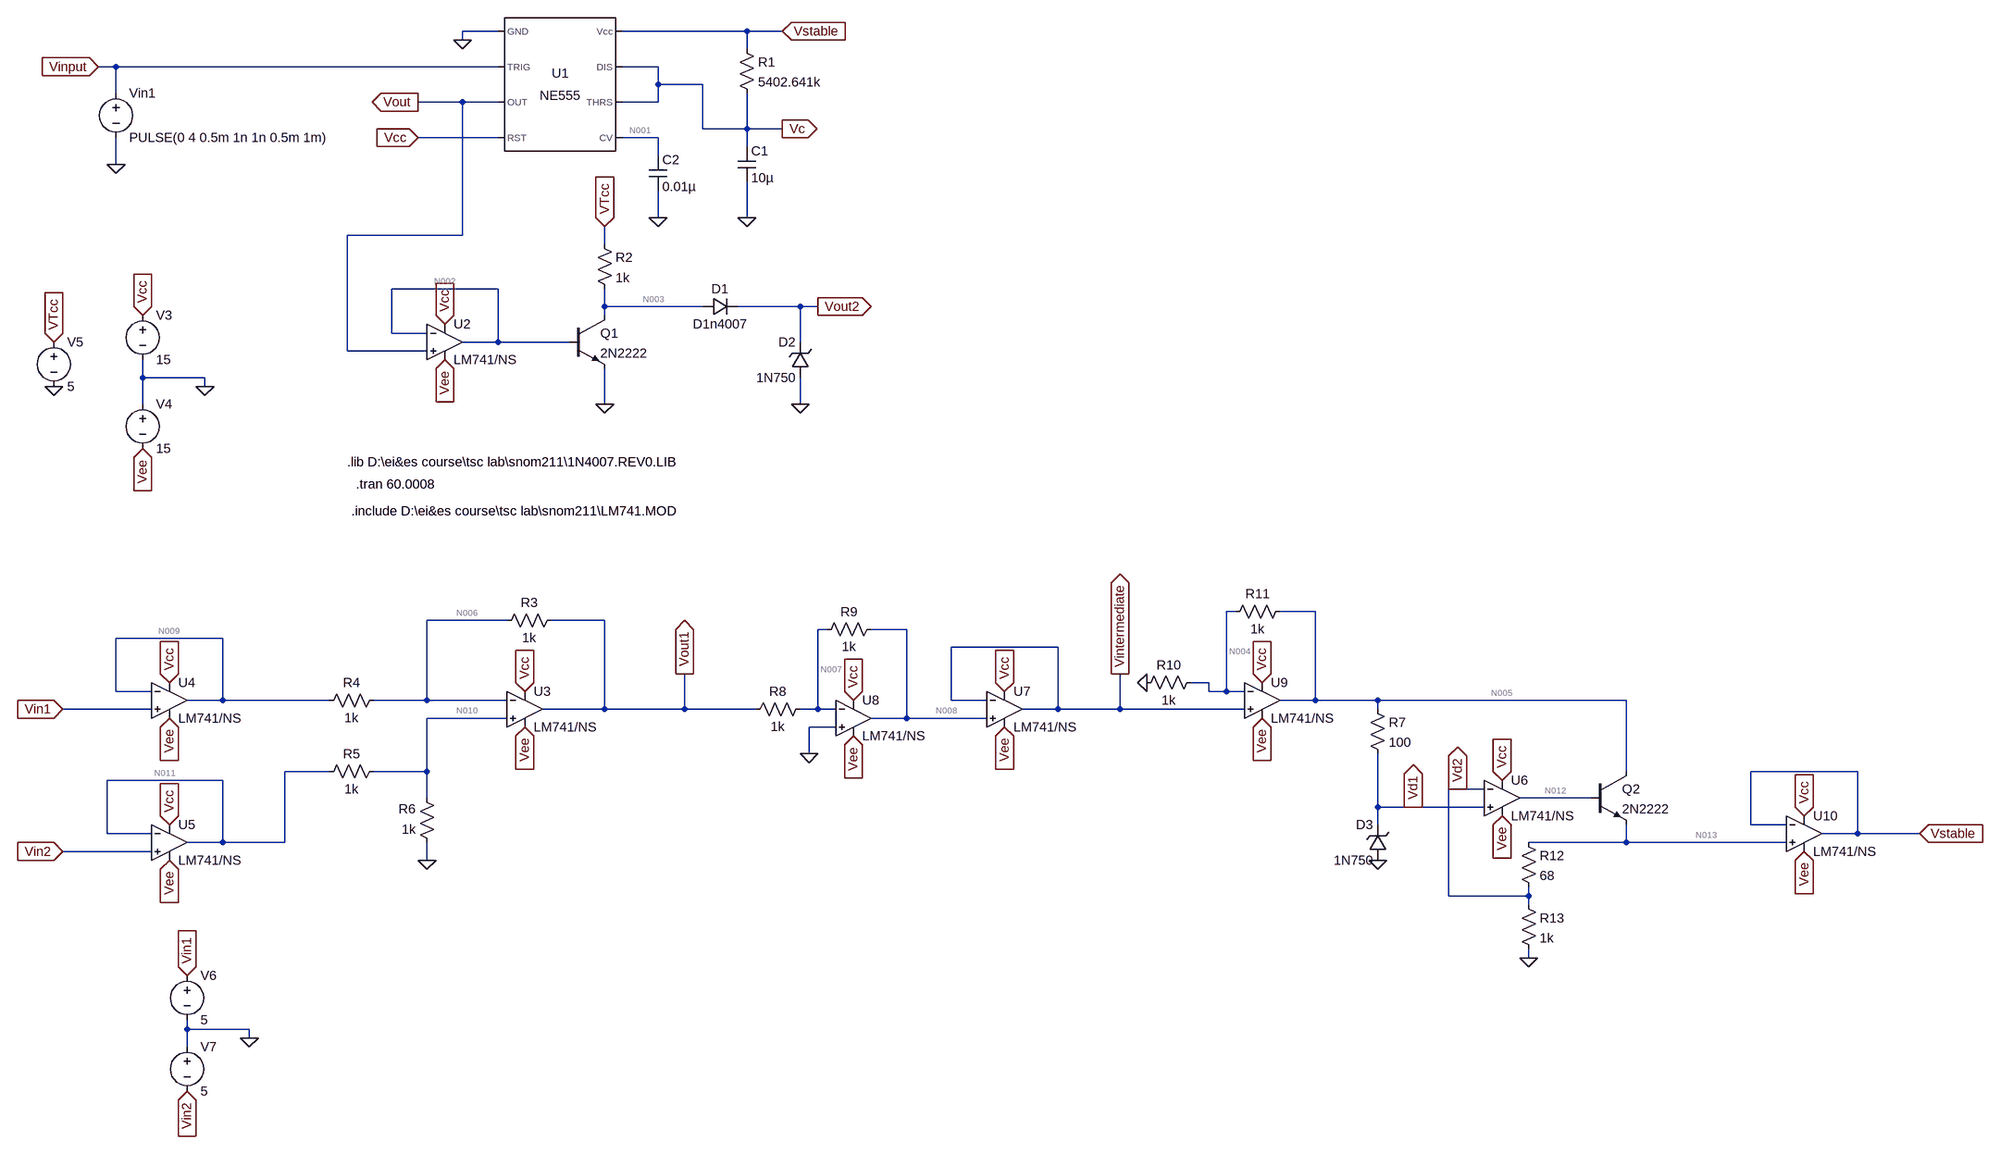
[diagram p0: schematic Project.asc]
Project.asc, the LTspice schematic file:
Version 4
SHEET 1 2816 2112
WIRE 112 64 48 64
WIRE 560 64 336 64
WIRE 624 64 560 64
WIRE 48 80 48 64
WIRE 560 96 560 64
WIRE -576 128 -608 128
WIRE 112 128 -576 128
WIRE 400 128 336 128
WIRE 400 160 400 128
WIRE 480 160 400 160
WIRE -576 176 -576 128
WIRE 48 192 -32 192
WIRE 112 192 48 192
WIRE 400 192 400 160
WIRE 400 192 336 192
WIRE 480 240 480 160
WIRE 560 240 560 176
WIRE 560 240 480 240
WIRE 624 240 560 240
WIRE 112 256 -32 256
WIRE 400 256 336 256
WIRE 560 272 560 240
WIRE 400 288 400 256
WIRE -576 304 -576 256
WIRE 400 400 400 352
WIRE 560 400 560 336
WIRE 48 432 48 192
WIRE 48 432 -160 432
WIRE 304 448 304 416
WIRE 112 528 -80 528
WIRE 304 560 304 528
WIRE 480 560 304 560
WIRE 656 560 544 560
WIRE 688 560 656 560
WIRE 304 576 304 560
WIRE -80 608 -80 528
WIRE -16 608 -80 608
WIRE 112 624 112 528
WIRE 112 624 48 624
WIRE 240 624 112 624
WIRE 656 624 656 560
WIRE -160 640 -160 432
WIRE -16 640 -160 640
WIRE -528 688 -528 656
WIRE -416 688 -528 688
WIRE -416 704 -416 688
WIRE -528 736 -528 688
WIRE 304 736 304 672
WIRE 656 736 656 688
WIRE 1440 1136 1424 1136
WIRE 1584 1136 1520 1136
WIRE 128 1152 -16 1152
WIRE 304 1152 208 1152
WIRE 704 1168 688 1168
WIRE 848 1168 784 1168
WIRE -384 1184 -576 1184
WIRE 1120 1200 928 1200
WIRE 1392 1264 1360 1264
WIRE -576 1280 -576 1184
WIRE -512 1280 -576 1280
WIRE 1392 1280 1392 1264
WIRE 1424 1280 1424 1136
WIRE 1424 1280 1392 1280
WIRE 1456 1280 1424 1280
WIRE -384 1296 -384 1184
WIRE -384 1296 -448 1296
WIRE -192 1296 -384 1296
WIRE -16 1296 -16 1152
WIRE -16 1296 -112 1296
WIRE 128 1296 -16 1296
WIRE 928 1296 928 1200
WIRE 992 1296 928 1296
WIRE 1584 1296 1584 1136
WIRE 1584 1296 1520 1296
WIRE 1696 1296 1584 1296
WIRE 2144 1296 1696 1296
WIRE -512 1312 -672 1312
WIRE 304 1312 304 1152
WIRE 304 1312 192 1312
WIRE 448 1312 448 1248
WIRE 448 1312 304 1312
WIRE 576 1312 448 1312
WIRE 688 1312 688 1168
WIRE 688 1312 656 1312
WIRE 720 1312 688 1312
WIRE 1120 1312 1120 1200
WIRE 1120 1312 1056 1312
WIRE 1232 1312 1232 1248
WIRE 1232 1312 1120 1312
WIRE 1456 1312 1232 1312
WIRE 1696 1312 1696 1296
WIRE 128 1328 -16 1328
WIRE 848 1328 848 1168
WIRE 848 1328 784 1328
WIRE 992 1328 848 1328
WIRE 720 1344 672 1344
WIRE 672 1392 672 1344
WIRE -192 1424 -272 1424
WIRE -16 1424 -16 1328
WIRE -16 1424 -112 1424
WIRE 2144 1424 2144 1296
WIRE 2560 1424 2368 1424
WIRE -384 1440 -592 1440
WIRE 1840 1456 1824 1456
WIRE 1888 1456 1840 1456
WIRE -16 1472 -16 1424
WIRE 2080 1472 1952 1472
WIRE 1696 1488 1696 1392
WIRE 1760 1488 1696 1488
WIRE 1888 1488 1760 1488
WIRE 1696 1520 1696 1488
WIRE 2368 1520 2368 1424
WIRE 2432 1520 2368 1520
WIRE -592 1536 -592 1440
WIRE -512 1536 -592 1536
WIRE 2560 1536 2560 1424
WIRE 2560 1536 2496 1536
WIRE 2672 1536 2560 1536
WIRE -384 1552 -384 1440
WIRE -384 1552 -448 1552
WIRE -272 1552 -272 1424
WIRE -272 1552 -384 1552
WIRE 2144 1552 2144 1520
WIRE 2144 1552 1968 1552
WIRE 2432 1552 2144 1552
WIRE -512 1568 -672 1568
WIRE -16 1584 -16 1552
WIRE 1824 1648 1824 1456
WIRE 1968 1648 1968 1632
WIRE 1968 1648 1824 1648
WIRE 1968 1664 1968 1648
WIRE 1968 1760 1968 1744
WIRE -448 1888 -448 1872
WIRE -336 1888 -448 1888
WIRE -336 1904 -336 1888
WIRE -448 1920 -448 1888
FLAG 560 400 0
FLAG 304 736 0
FLAG 656 736 0
FLAG 16 592 Vcc
IOPIN 16 592 In
FLAG 16 656 Vee
IOPIN 16 656 In
FLAG -416 704 0
FLAG -528 576 Vcc
IOPIN -528 576 In
FLAG -528 816 Vee
IOPIN -528 816 In
FLAG 688 560 Vout2
IOPIN 688 560 Out
FLAG -688 704 0
FLAG -688 624 VTcc
IOPIN -688 624 In
FLAG 624 64 Vstable
IOPIN 624 64 In
FLAG -32 256 Vcc
IOPIN -32 256 In
FLAG 624 240 Vc
IOPIN 624 240 Out
FLAG 400 400 0
FLAG 48 80 0
FLAG -576 304 0
FLAG -608 128 Vinput
IOPIN -608 128 In
FLAG -32 192 Vout
IOPIN -32 192 Out
FLAG 304 416 VTcc
IOPIN 304 416 In
FLAG 160 1280 Vcc
IOPIN 160 1280 In
FLAG 160 1344 Vee
IOPIN 160 1344 In
FLAG -16 1584 0
FLAG -480 1264 Vcc
IOPIN -480 1264 In
FLAG -480 1328 Vee
IOPIN -480 1328 In
FLAG -480 1520 Vcc
IOPIN -480 1520 In
FLAG -480 1584 Vee
IOPIN -480 1584 In
FLAG -672 1312 Vin1
IOPIN -672 1312 In
FLAG -672 1568 Vin2
IOPIN -672 1568 In
FLAG -336 1904 0
FLAG -448 1792 Vin1
IOPIN -448 1792 In
FLAG -448 2000 Vin2
IOPIN -448 2000 In
FLAG 1920 1440 Vcc
IOPIN 1920 1440 In
FLAG 1920 1504 Vee
IOPIN 1920 1504 In
FLAG 1696 1584 0
FLAG 1024 1280 Vcc
IOPIN 1024 1280 In
FLAG 1024 1344 Vee
IOPIN 1024 1344 In
FLAG 448 1248 Vout1
IOPIN 448 1248 Out
FLAG 1232 1248 Vintermediate
IOPIN 1232 1248 Out
FLAG 752 1296 Vcc
IOPIN 752 1296 In
FLAG 752 1360 Vee
IOPIN 752 1360 In
FLAG 672 1392 0
FLAG 1760 1488 Vd1
IOPIN 1760 1488 Out
FLAG 1840 1456 Vd2
IOPIN 1840 1456 Out
FLAG 1488 1264 Vcc
IOPIN 1488 1264 In
FLAG 1488 1328 Vee
IOPIN 1488 1328 In
FLAG 1280 1264 0
FLAG 1968 1760 0
FLAG 2464 1504 Vcc
IOPIN 2464 1504 In
FLAG 2464 1568 Vee
IOPIN 2464 1568 In
FLAG 2672 1536 Vstable
IOPIN 2672 1536 In
SYMBOL Misc\\NE555 224 160 R0
SYMATTR InstName U1
SYMBOL voltage -576 160 R0
WINDOW 123 0 0 Left 0
WINDOW 39 0 0 Left 0
SYMATTR InstName Vin1
SYMATTR Value PULSE(0 4 0.5m 1n 1n 0.5m 1m)
SYMBOL res 544 80 R0
SYMATTR InstName R1
SYMATTR Value 5402.641k
SYMBOL cap 384 288 R0
SYMATTR InstName C2
SYMATTR Value 0.01µ
SYMBOL cap 544 272 R0
SYMATTR InstName C1
SYMATTR Value 10µ
SYMBOL npn 240 576 R0
SYMATTR InstName Q1
SYMATTR Value 2N2222
SYMBOL diode 480 576 R270
WINDOW 0 32 32 VTop 2
WINDOW 3 0 32 VBottom 2
SYMATTR InstName D1
SYMATTR Value D1n4007
SYMBOL zener 672 688 R180
WINDOW 0 24 64 Left 2
WINDOW 3 24 0 Left 2
SYMATTR InstName D2
SYMATTR Value 1N750
SYMBOL OpAmps\\opamp2 16 560 R0
SYMATTR InstName U2
SYMATTR Value LM741/NS
SYMBOL voltage -528 560 R0
WINDOW 123 0 0 Left 0
WINDOW 39 0 0 Left 0
SYMATTR InstName V3
SYMATTR Value 15
SYMBOL voltage -528 720 R0
WINDOW 123 0 0 Left 0
WINDOW 39 0 0 Left 0
SYMATTR InstName V4
SYMATTR Value 15
SYMBOL voltage -688 608 R0
WINDOW 123 0 0 Left 0
WINDOW 39 0 0 Left 0
SYMATTR InstName V5
SYMATTR Value 5
SYMBOL res 288 432 R0
SYMATTR InstName R2
SYMATTR Value 1k
SYMBOL OpAmps\\opamp2 160 1248 R0
SYMATTR InstName U3
SYMATTR Value LM741/NS
SYMBOL res 224 1136 R90
WINDOW 0 0 56 VBottom 2
WINDOW 3 32 56 VTop 2
SYMATTR InstName R3
SYMATTR Value 1k
SYMBOL res -96 1280 R90
WINDOW 0 0 56 VBottom 2
WINDOW 3 32 56 VTop 2
SYMATTR InstName R4
SYMATTR Value 1k
SYMBOL res -96 1408 R90
WINDOW 0 0 56 VBottom 2
WINDOW 3 32 56 VTop 2
SYMATTR InstName R5
SYMATTR Value 1k
SYMBOL res 0 1568 R180
WINDOW 0 36 76 Left 2
WINDOW 3 36 40 Left 2
SYMATTR InstName R6
SYMATTR Value 1k
SYMBOL OpAmps\\opamp2 -480 1232 R0
SYMATTR InstName U4
SYMATTR Value LM741/NS
SYMBOL OpAmps\\opamp2 -480 1488 R0
SYMATTR InstName U5
SYMATTR Value LM741/NS
SYMBOL voltage -448 1776 R0
WINDOW 123 0 0 Left 0
WINDOW 39 0 0 Left 0
SYMATTR InstName V6
SYMATTR Value 5
SYMBOL voltage -448 1904 R0
WINDOW 123 0 0 Left 0
WINDOW 39 0 0 Left 0
SYMATTR InstName V7
SYMATTR Value 5
SYMBOL npn 2080 1424 R0
SYMATTR InstName Q2
SYMATTR Value 2N2222
SYMBOL OpAmps\\opamp2 1920 1408 R0
SYMATTR InstName U6
SYMATTR Value LM741/NS
SYMBOL res 1680 1296 R0
SYMATTR InstName R7
SYMATTR Value 100
SYMATTR SpiceLine pwr=0.25
SYMBOL zener 1712 1584 R180
WINDOW 0 24 64 Left 2
WINDOW 3 24 0 Left 2
SYMATTR InstName D3
SYMATTR Value 1N750
SYMBOL OpAmps\\opamp2 1024 1248 R0
SYMATTR InstName U7
SYMATTR Value LM741/NS
SYMBOL OpAmps\\opamp2 752 1264 R0
SYMATTR InstName U8
SYMATTR Value LM741/NS
SYMBOL res 672 1296 R90
WINDOW 0 0 56 VBottom 2
WINDOW 3 32 56 VTop 2
SYMATTR InstName R8
SYMATTR Value 1k
SYMBOL res 800 1152 R90
WINDOW 0 0 56 VBottom 2
WINDOW 3 32 56 VTop 2
SYMATTR InstName R9
SYMATTR Value 1k
SYMBOL OpAmps\\opamp2 1488 1232 R0
SYMATTR InstName U9
SYMATTR Value LM741/NS
SYMBOL res 1376 1248 R90
WINDOW 0 0 56 VBottom 2
WINDOW 3 32 56 VTop 2
SYMATTR InstName R10
SYMATTR Value 1k
SYMBOL res 1536 1120 R90
WINDOW 0 0 56 VBottom 2
WINDOW 3 32 56 VTop 2
SYMATTR InstName R11
SYMATTR Value 1k
SYMBOL res 1952 1536 R0
SYMATTR InstName R12
SYMATTR Value 68
SYMBOL res 1952 1648 R0
SYMATTR InstName R13
SYMATTR Value 1k
SYMBOL OpAmps\\opamp2 2464 1472 R0
SYMATTR InstName U10
SYMATTR Value LM741/NS
TEXT -144 880 Left 2 !.tran 60.0008
TEXT -160 840 Left 2 !.lib D:\\ei&es course\\tsc lab\\snom211\\1N4007.REV0.LIB
TEXT -152 928 Left 2 !.include D:\\ei&es course\\tsc lab\\snom211\\LM741.MOD

The netlist it stands for:
* Project.asc
XU1 0 Vinput Vout Vcc N001 Vc Vc Vstable NE555  ; pins GND TRIG OUT RST CV THRS DIS Vcc
Vin1 Vinput 0 PULSE(0 4 0.5m 1n 1n 0.5m 1m)
R1 Vstable Vc 5402.641k
C2 N001 0 0.01µ
C1 Vc 0 10µ
Q1 N003 N002 0 0 2N2222
D1 N003 Vout2 D1n4007
D2 0 Vout2 1N750
XU2 Vout N002 Vcc Vee N002 LM741/NS  ; pins In+ In- V+ V- OUT
V3 Vcc 0 15
V4 0 Vee 15
V5 VTcc 0 5
R2 VTcc N003 1k
XU3 N010 N006 Vcc Vee Vout1 LM741/NS  ; pins In+ In- V+ V- OUT
R3 Vout1 N006 1k
R4 N006 N009 1k
R5 N010 N011 1k
R6 0 N010 1k
XU4 Vin1 N009 Vcc Vee N009 LM741/NS  ; pins In+ In- V+ V- OUT
XU5 Vin2 N011 Vcc Vee N011 LM741/NS  ; pins In+ In- V+ V- OUT
V6 Vin1 0 5
V7 0 Vin2 5
Q2 N005 N012 N013 0 2N2222
XU6 Vd1 Vd2 Vcc Vee N012 LM741/NS  ; pins In+ In- V+ V- OUT
R7 N005 Vd1 100 pwr=0.25
D3 0 Vd1 1N750
XU7 N008 Vintermediate Vcc Vee Vintermediate LM741/NS  ; pins In+ In- V+ V- OUT
XU8 0 N007 Vcc Vee N008 LM741/NS  ; pins In+ In- V+ V- OUT
R8 N007 Vout1 1k
R9 N008 N007 1k
XU9 Vintermediate N004 Vcc Vee N005 LM741/NS  ; pins In+ In- V+ V- OUT
R10 N004 0 1k
R11 N005 N004 1k
R12 N013 Vd2 68
R13 Vd2 0 1k
XU10 N013 Vstable Vcc Vee Vstable LM741/NS  ; pins In+ In- V+ V- OUT
.model D D
.lib standard.dio
.model NPN NPN
.model PNP PNP
.lib standard.bjt
.tran 60.0008
.lib D:\ei&es course\tsc lab\snom211\1N4007.REV0.LIB
.include D:\ei&es course\tsc lab\snom211\LM741.MOD
.lib NE555.sub
.backanno
.end

* Results of the author's LTspice run, read from the files saved beside the schematic
* Operating Point, zero values left out:
*   V(n001) = 3.342 V
*   V(vstable) = 5.012 V
*   V(vc) = 4.95 V
*   V(vout) = 5.012 V
*   V(vcc) = 15 V
*   V(n003) = 18.4 mV
*   V(n002) = 1.037 V
*   V(vout2) = 13.34 mV
*   V(vee) = -15 V
*   V(vtcc) = 5 V
*   V(n006) = -2.499 V
*   V(n010) = -2.5 V
*   V(vout1) = -9.998 V
*   V(n009) = 5.001 V
*   V(n011) = -4.999 V
*   V(vin1) = 5 V
*   V(vin2) = -5 V
*   V(n005) = 6.38 V
*   V(n012) = 5.708 V
*   V(n013) = 5.011 V
*   V(vd2) = 4.692 V
*   V(vd1) = 4.691 V
*   V(vintermediate) = 10 V
*   V(n008) = 10 V
*   V(n007) = 948.2 µV
*   V(n004) = 3.197 V
*   Ic(Q2) = 4.669 mA
*   Ib(Q2) = 23.55 µA
*   Ie(Q2) = -4.692 mA
*   Ic(Q1) = 4.982 mA
*   Ib(Q1) = 25.32 mA
*   Ie(Q1) = -30.3 mA
*   I(D3) = -16.88 mA
*   I(D2) = -803.4 pA
*   I(D1) = 803.4 pA
*   I(R13) = 4.692 mA
*   I(R12) = 4.692 mA
*   I(R11) = 3.183 mA
*   I(R10) = 3.197 mA
*   I(R9) = 9.999 mA
*   I(R8) = 9.999 mA
*   I(R7) = 16.89 mA
*   I(R6) = 2.5 mA
*   I(R5) = 2.5 mA
*   I(R4) = -7.5 mA
*   I(R3) = -7.5 mA
*   I(R2) = 4.982 mA
*   I(R1) = 11.55 nA
*   I(V7) = 58.08 nA
*   I(V6) = -57.64 nA
*   I(V5) = -4.982 mA
*   I(V4) = -34.76 mA
*   I(V3) = -84.03 mA